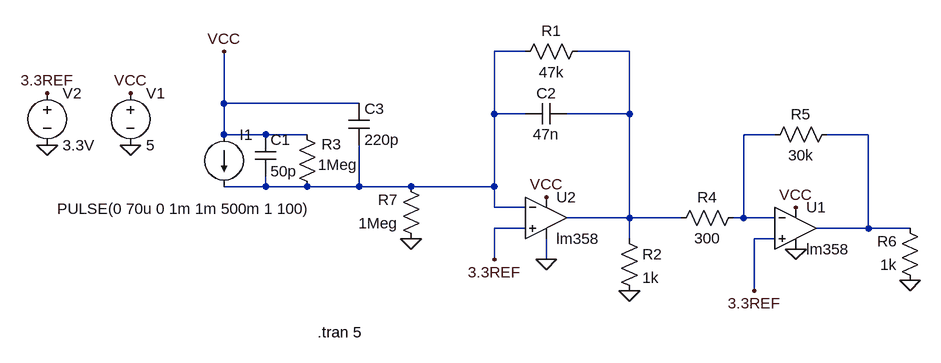
[diagram p0: schematic photodetector_circuit.asc]
photodetector_circuit.asc, the LTspice schematic file:
Version 4
SHEET 1 964 680
WIRE 352 -64 304 -64
WIRE 512 -64 432 -64
WIRE -112 16 -112 -64
WIRE 96 16 -112 16
WIRE 304 32 304 -64
WIRE 352 32 304 32
WIRE 512 32 512 -64
WIRE 512 32 416 32
WIRE -112 64 -112 16
WIRE -48 64 -112 64
WIRE 16 64 -48 64
WIRE 736 64 688 64
WIRE 880 64 816 64
WIRE -48 144 -48 128
WIRE -48 144 -112 144
WIRE 16 144 -48 144
WIRE 96 144 96 80
WIRE 96 144 16 144
WIRE 176 144 96 144
WIRE 304 144 304 32
WIRE 304 144 176 144
WIRE 304 176 304 144
WIRE 352 176 304 176
WIRE 512 192 512 32
WIRE 512 192 416 192
WIRE 592 192 512 192
WIRE 688 192 688 64
WIRE 688 192 672 192
WIRE 736 192 688 192
WIRE 352 208 304 208
WIRE 880 208 880 64
WIRE 880 208 800 208
WIRE 944 208 880 208
WIRE 512 224 512 192
WIRE 736 224 704 224
WIRE 304 256 304 208
WIRE 384 256 384 224
WIRE 704 304 704 224
FLAG -256 0 VCC
FLAG 384 160 VCC
FLAG -256 80 0
FLAG 384 256 0
FLAG 176 224 0
FLAG -384 0 3.3REF
FLAG 304 256 3.3REF
FLAG 704 304 3.3REF
FLAG -384 80 0
FLAG 512 304 0
FLAG 944 288 0
FLAG 768 240 0
FLAG -112 -64 VCC
FLAG 768 176 VCC
SYMBOL res 448 -80 R90
WINDOW 0 0 56 VBottom 2
WINDOW 3 32 56 VTop 2
SYMATTR InstName R1
SYMATTR Value 47k
SYMBOL voltage -256 -16 R0
WINDOW 123 0 0 Left 0
WINDOW 39 0 0 Left 0
SYMATTR InstName V1
SYMATTR Value 5
SYMBOL lm358 384 128 R0
SYMATTR InstName U2
SYMBOL current -112 64 R0
WINDOW 3 -257 114 Left 2
WINDOW 123 0 0 Left 0
WINDOW 39 0 0 Left 0
SYMATTR Value PULSE(0 70u 0 1m 1m 500m 1 100)
SYMATTR InstName I1
SYMBOL cap -64 64 R0
SYMATTR InstName C1
SYMATTR Value 50p
SYMBOL res 0 48 R0
WINDOW 0 38 31 Left 2
WINDOW 3 33 62 Left 2
SYMATTR InstName R3
SYMATTR Value 1Meg
SYMBOL res 496 208 R0
SYMATTR InstName R2
SYMATTR Value 1k
SYMBOL cap 416 16 R90
WINDOW 0 0 32 VBottom 2
WINDOW 3 32 32 VTop 2
SYMATTR InstName C2
SYMATTR Value 47n
SYMBOL lm358 768 144 R0
SYMATTR InstName U1
SYMBOL res 688 176 R90
WINDOW 0 0 56 VBottom 2
WINDOW 3 32 56 VTop 2
SYMATTR InstName R4
SYMATTR Value 300
SYMBOL res 832 48 R90
WINDOW 0 0 56 VBottom 2
WINDOW 3 32 56 VTop 2
SYMATTR InstName R5
SYMATTR Value 30k
SYMBOL res 960 304 R180
WINDOW 0 36 76 Left 2
WINDOW 3 36 40 Left 2
SYMATTR InstName R6
SYMATTR Value 1k
SYMBOL voltage -384 -16 R0
WINDOW 123 0 0 Left 0
WINDOW 39 0 0 Left 0
SYMATTR InstName V2
SYMATTR Value 3.3V
SYMBOL res 192 240 R180
WINDOW 0 36 76 Left 2
WINDOW 3 36 40 Left 2
SYMATTR InstName R7
SYMATTR Value 1Meg
SYMBOL cap 80 16 R0
SYMATTR InstName C3
SYMATTR Value 220p
TEXT 32 368 Left 2 !.tran 5

The netlist it stands for:
* photodetector_circuit.asc
R1 N002 N001 47k
V1 VCC 0 5
* U2: lm358 (symbol lm358 not available, pins judged from their places): In+=3.3REF In-=N001 V+=VCC V-=0 OUT=N002
I1 VCC N001 PULSE(0 70u 0 1m 1m 500m 1 100)
C1 VCC N001 50p
R3 VCC N001 1Meg
R2 N002 0 1k
C2 N002 N001 47n
* U1: lm358 (symbol lm358 not available, pins judged from their places): In+=3.3REF In-=N003 V+=VCC V-=0 OUT=N004
R4 N003 N002 300
R5 N004 N003 30k
R6 0 N004 1k
V2 3.3REF 0 3.3V
R7 0 N001 1Meg
C3 VCC N001 220p
.tran 5
.backanno
.end